# EAGLE schematic 6R_Complete (EAGLE 9.5.0)
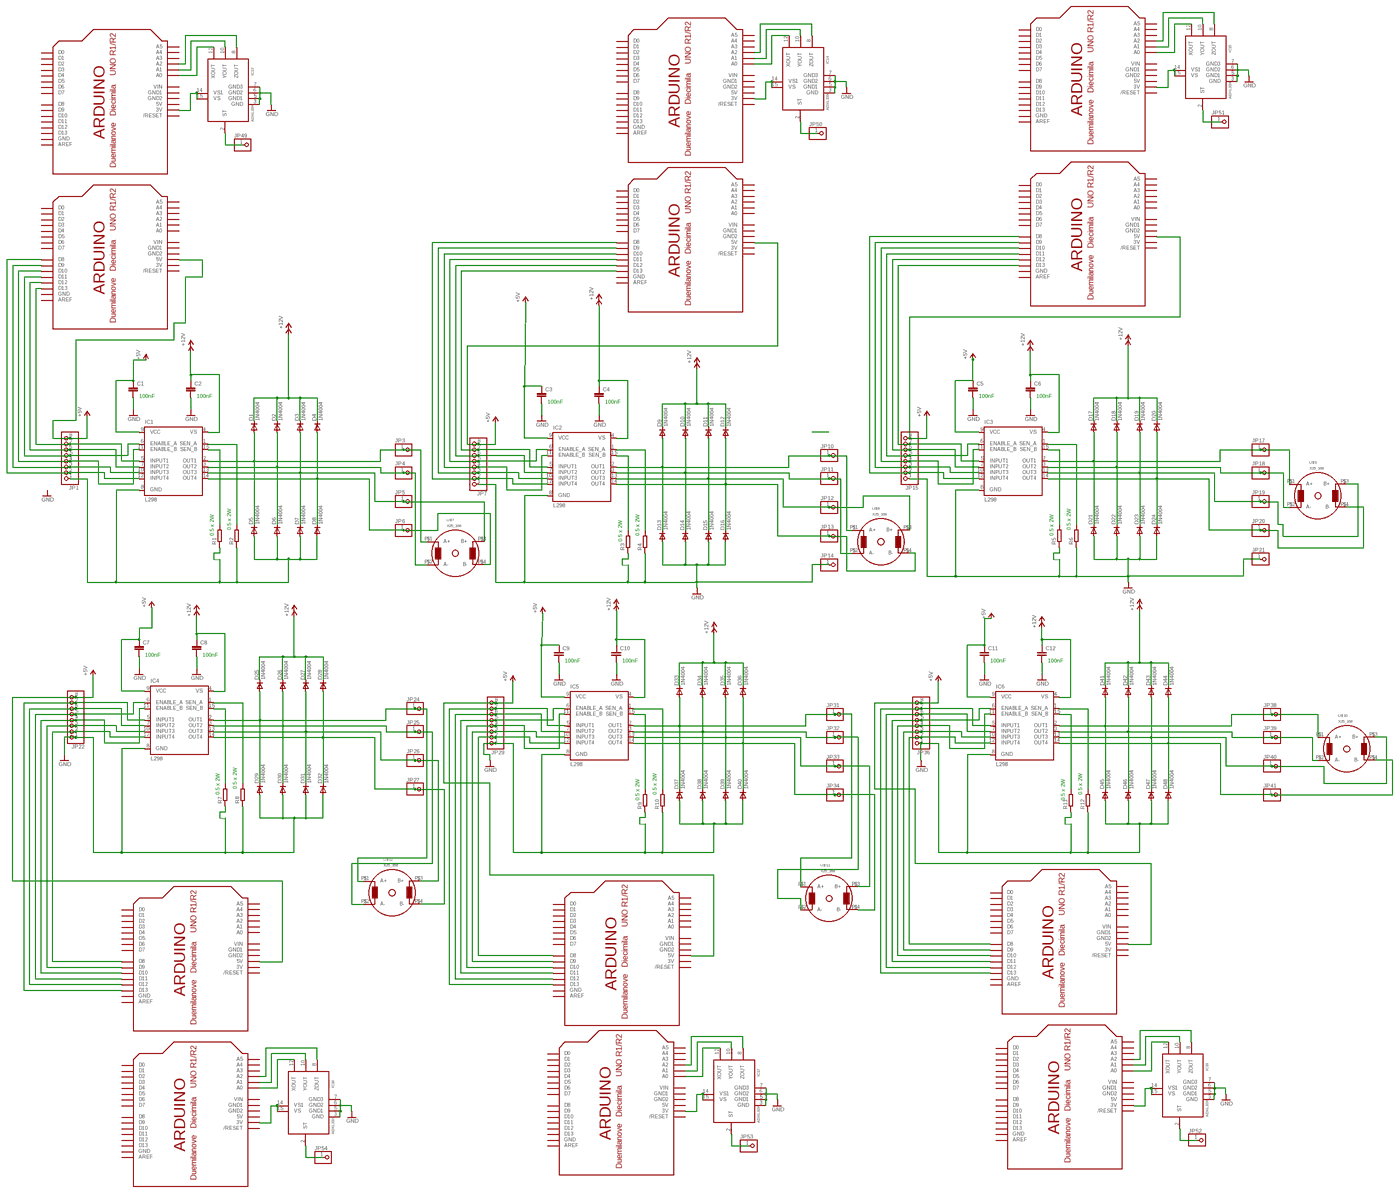
[diagram p0: schematic, sheet 1, overview]
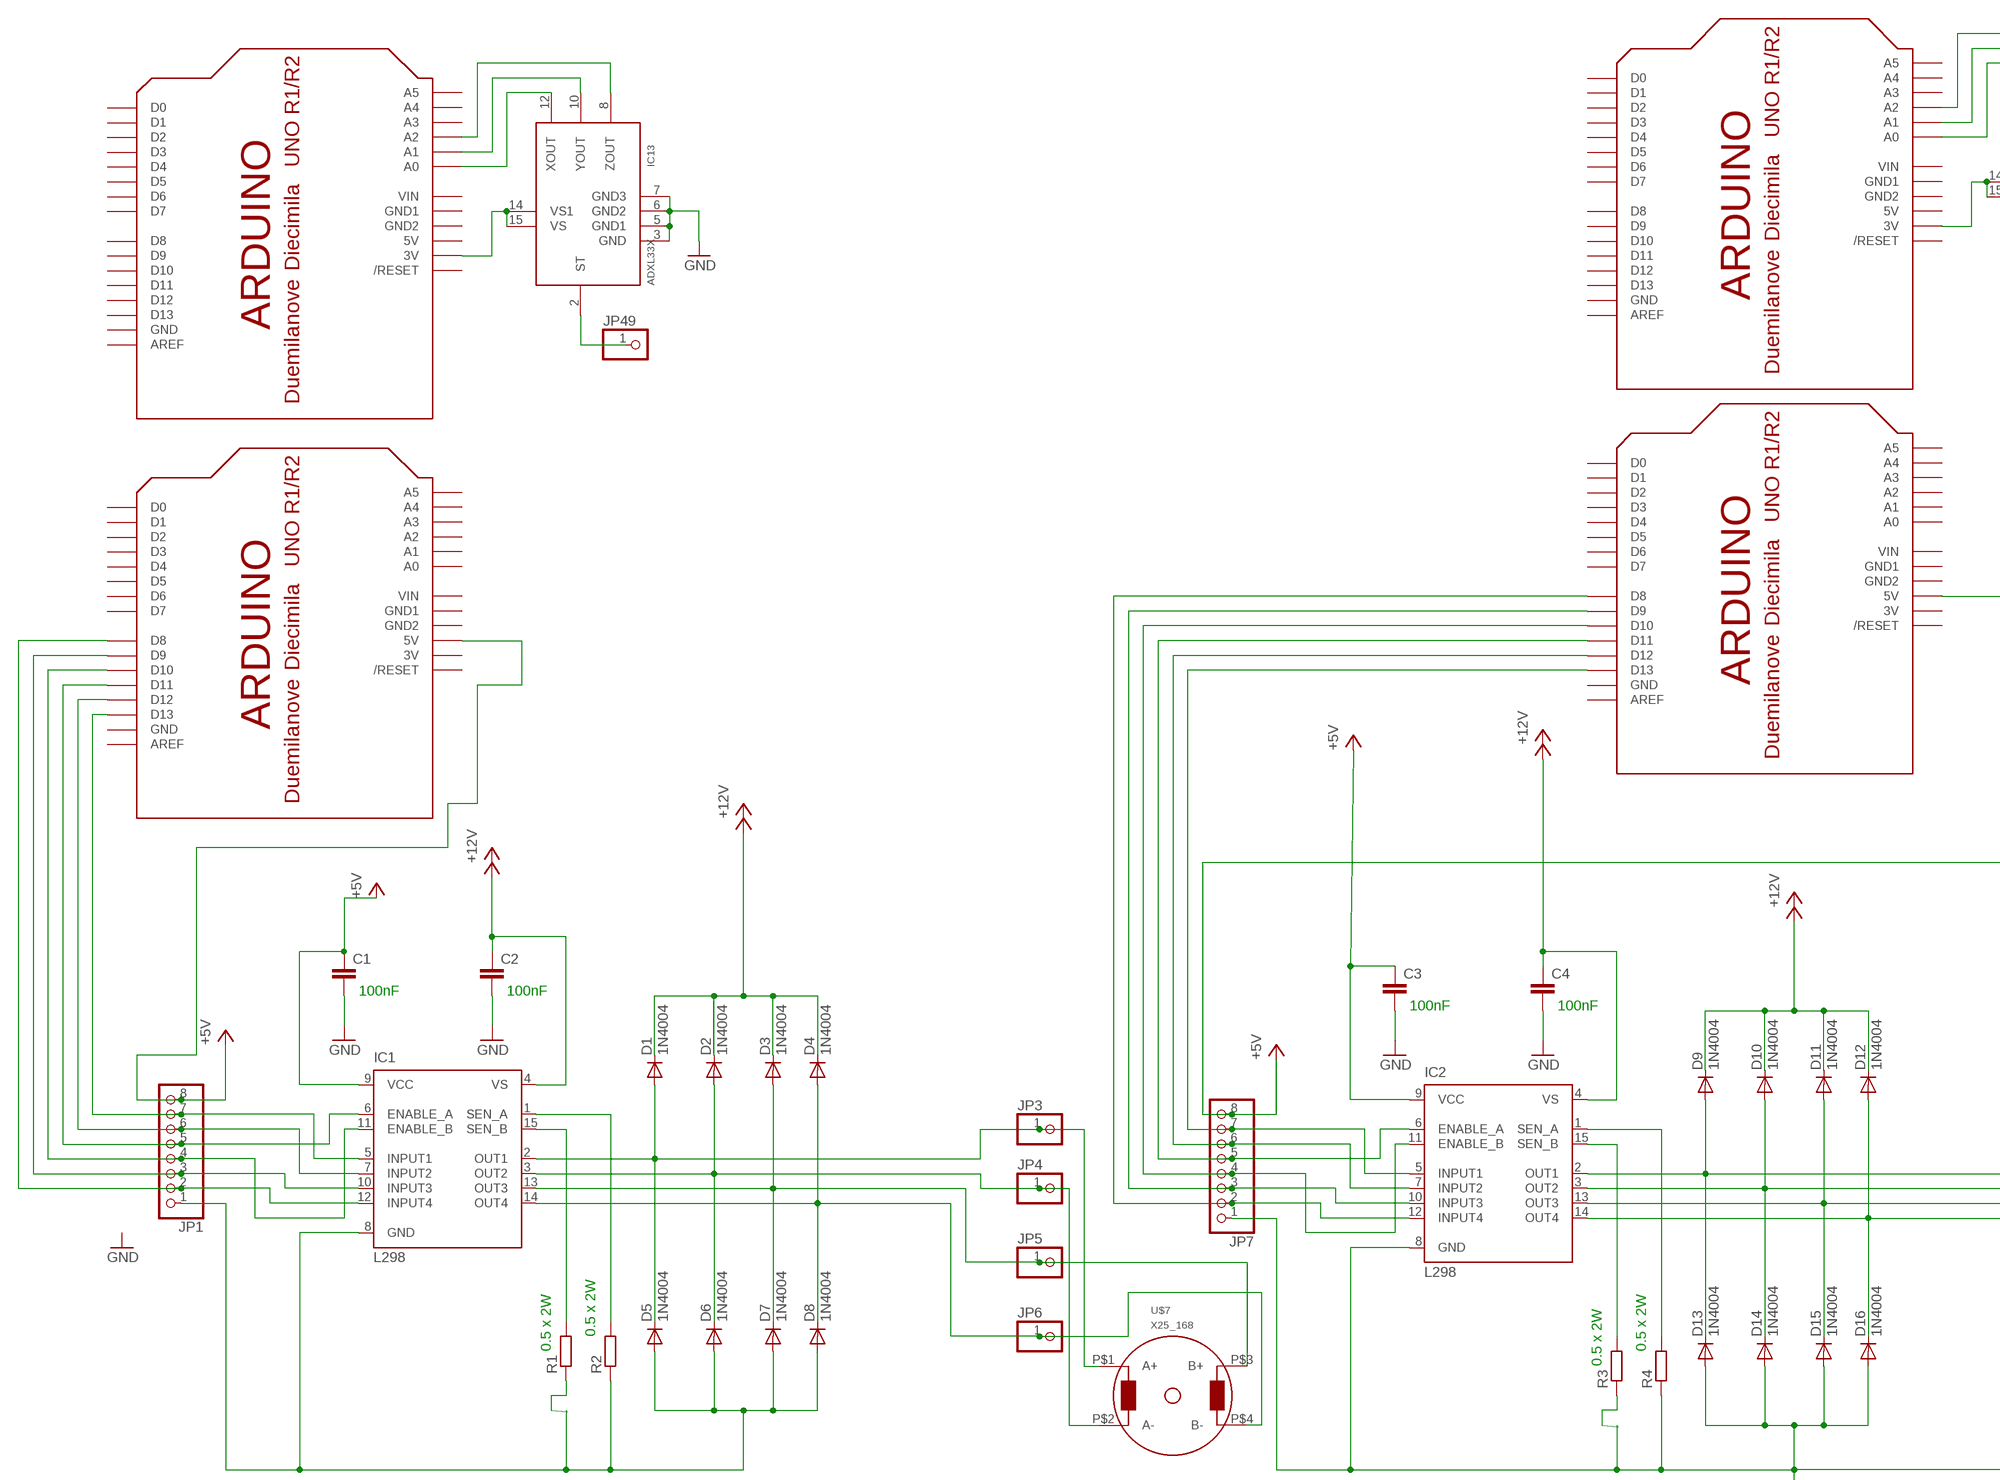
[diagram p1: schematic, sheet 1, part 1 of 4]
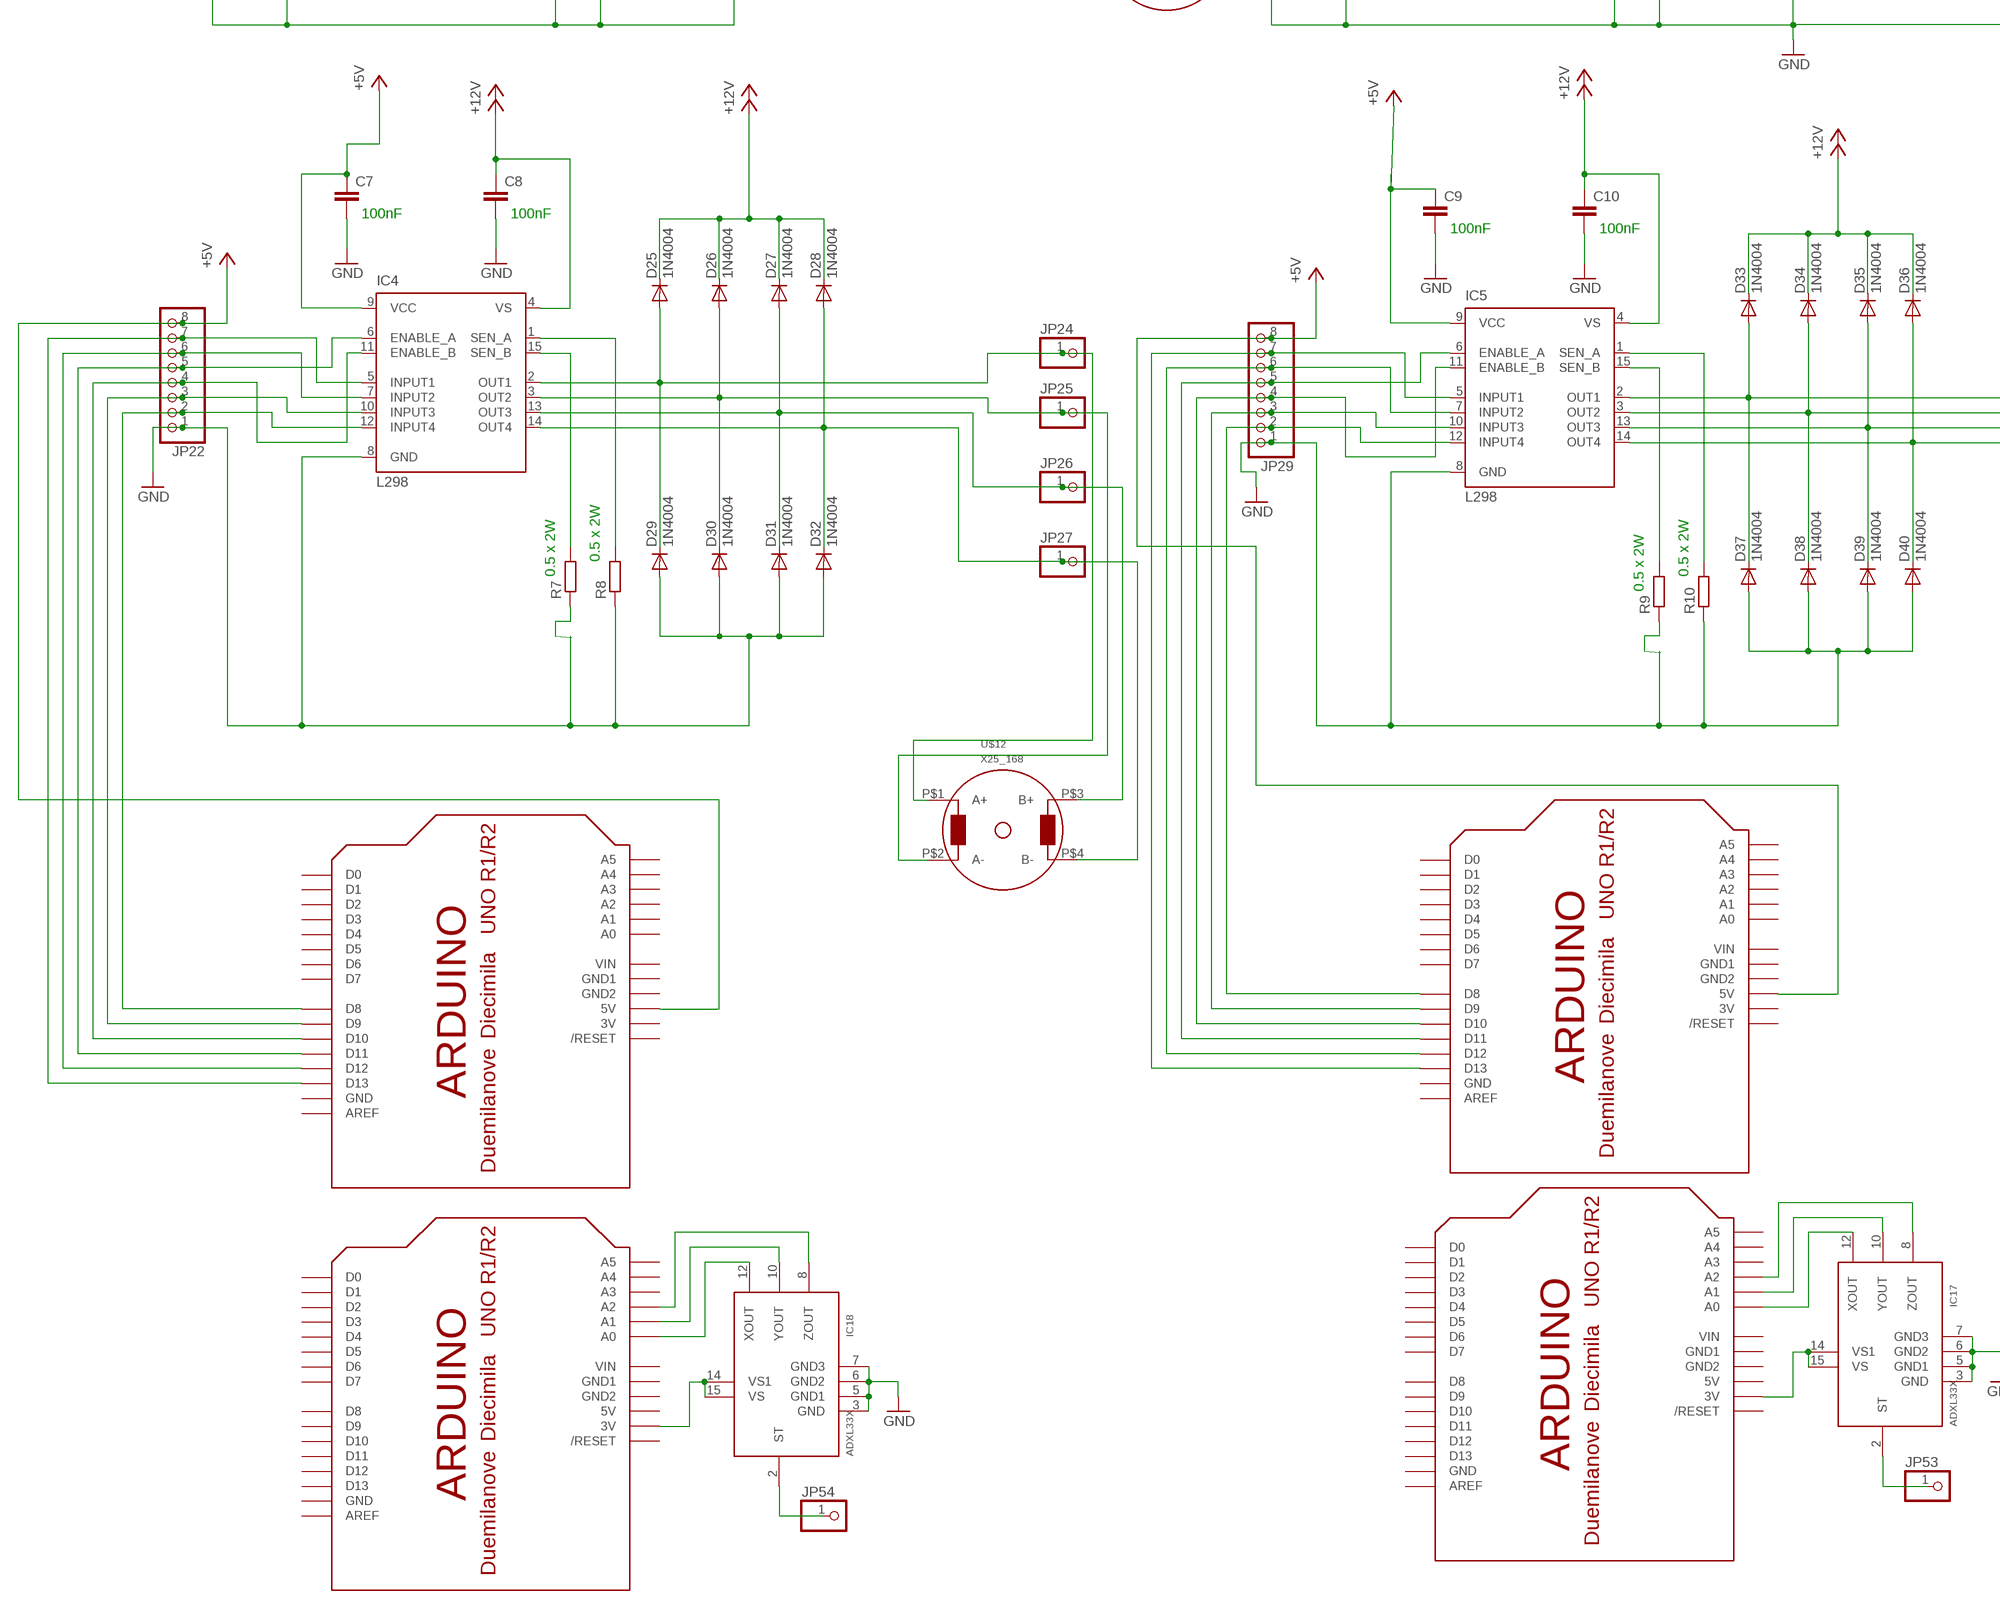
[diagram p2: schematic, sheet 1, part 2 of 4]
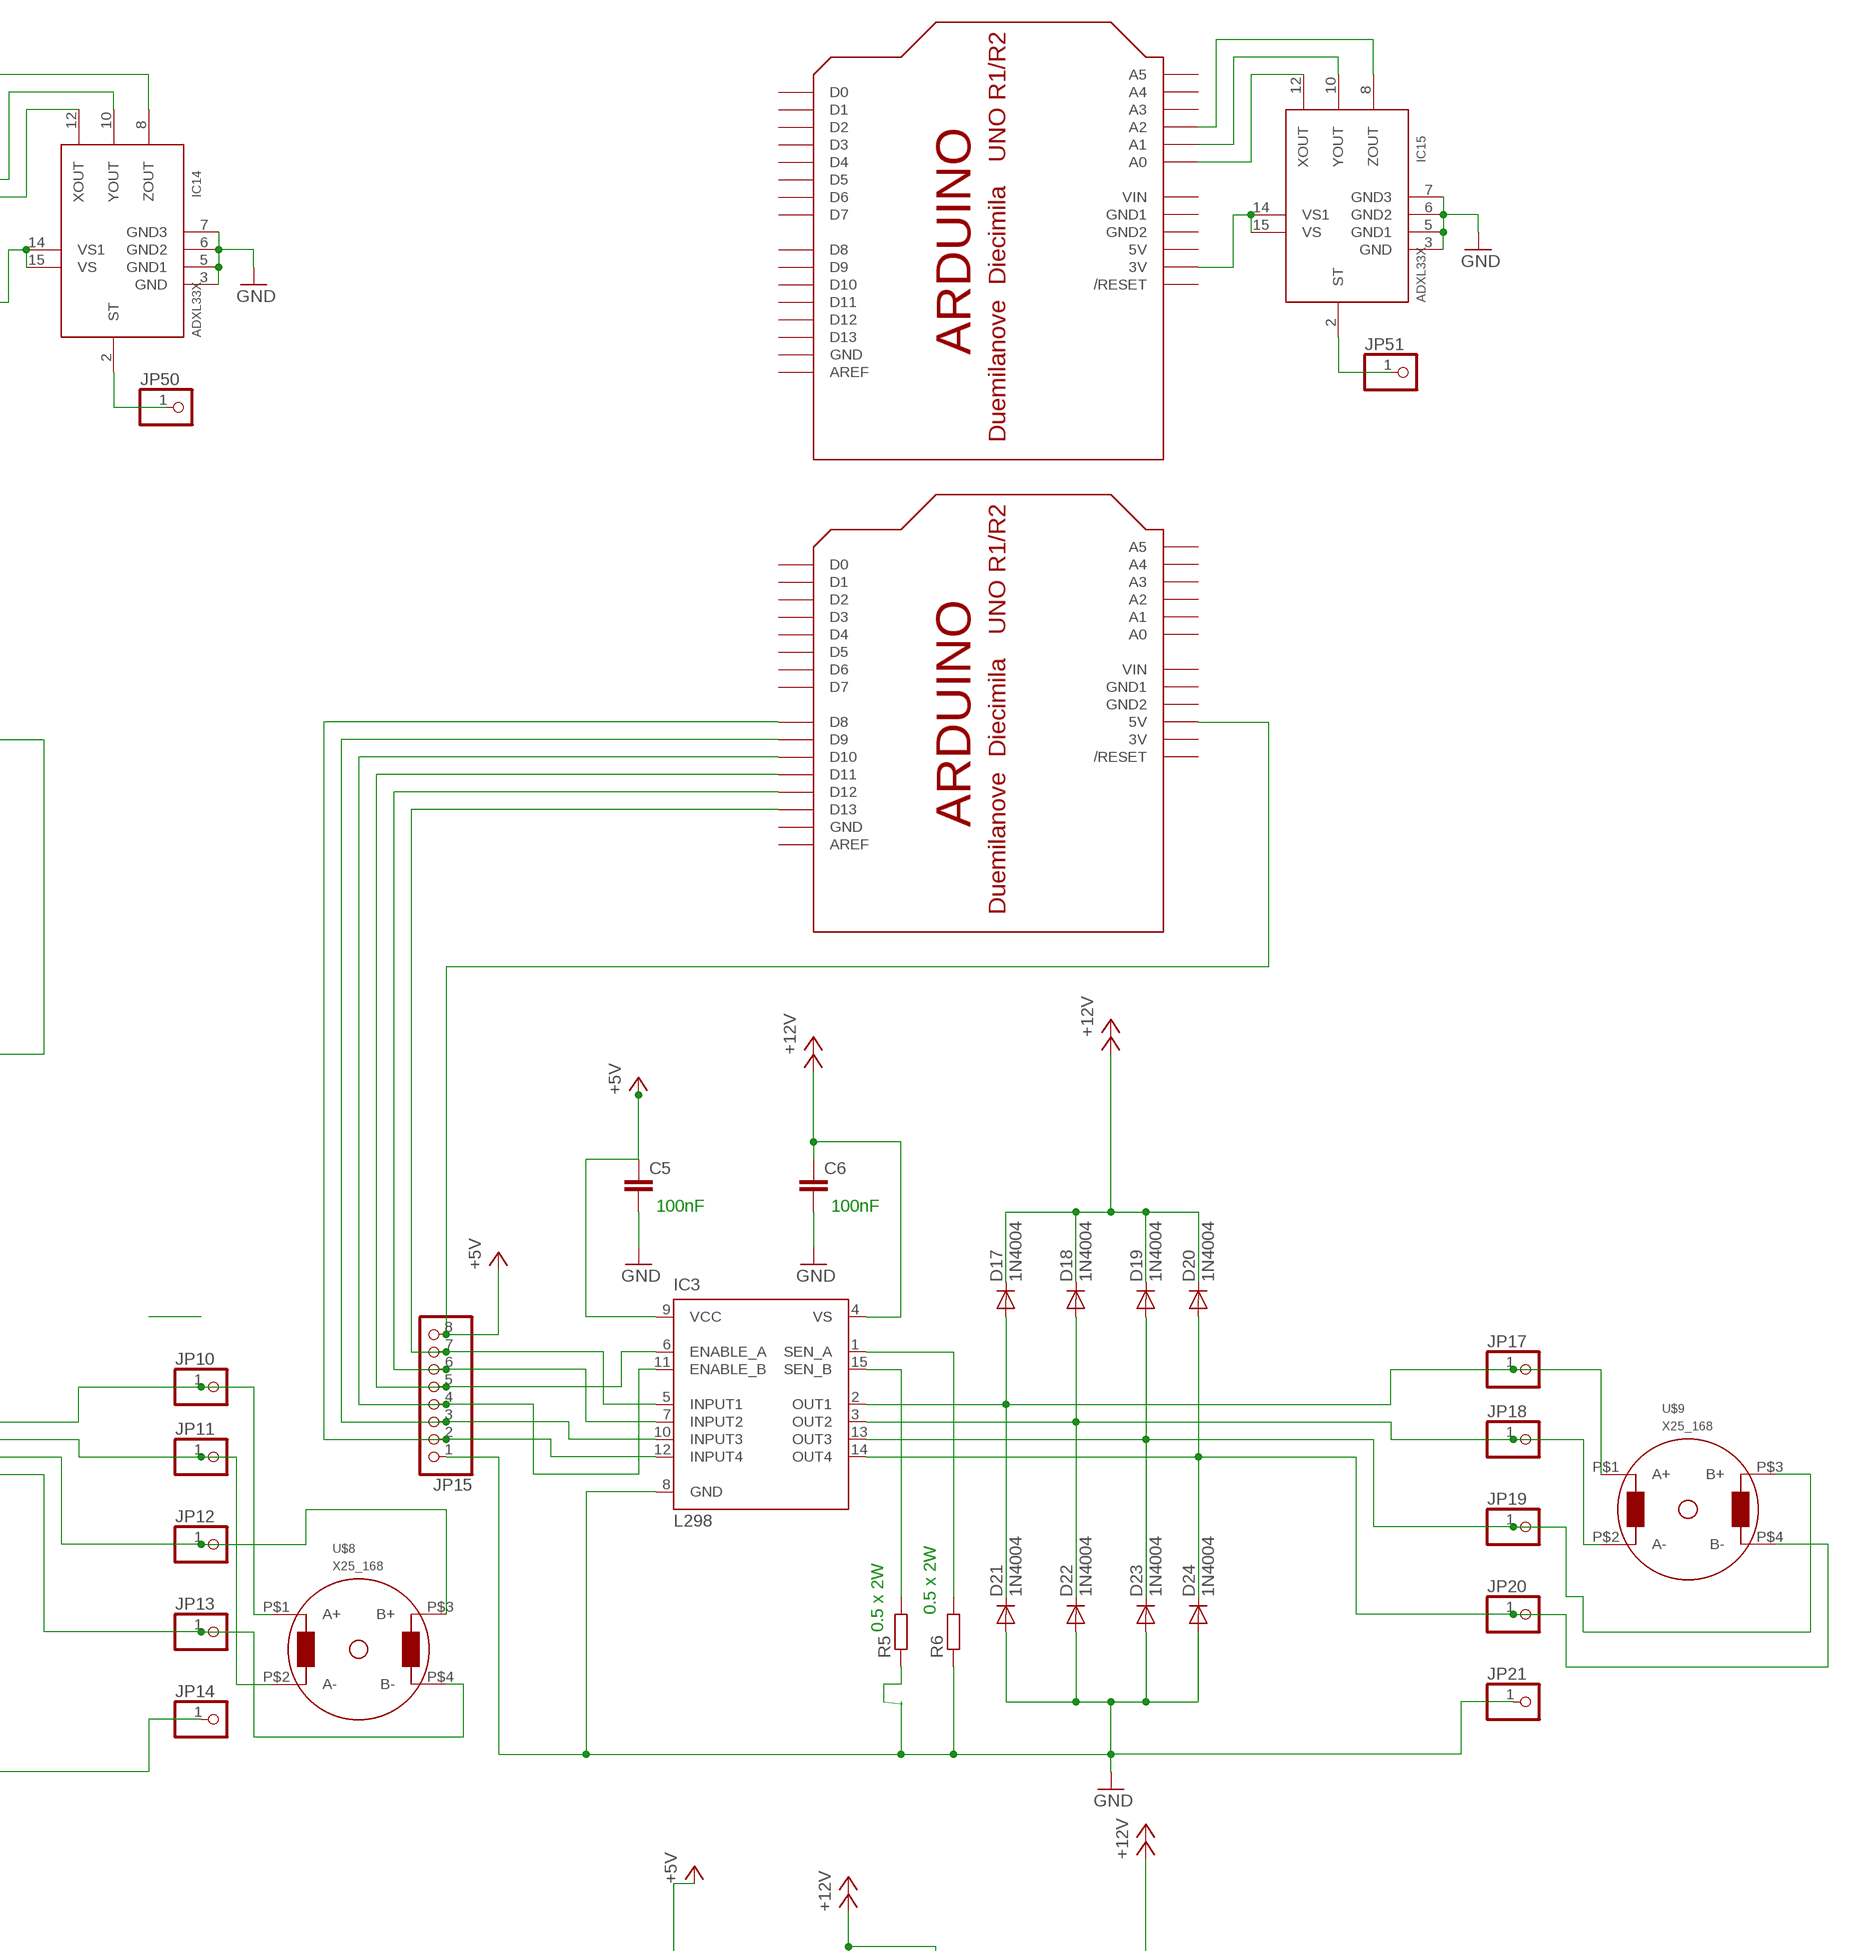
[diagram p3: schematic, sheet 1, part 3 of 4]
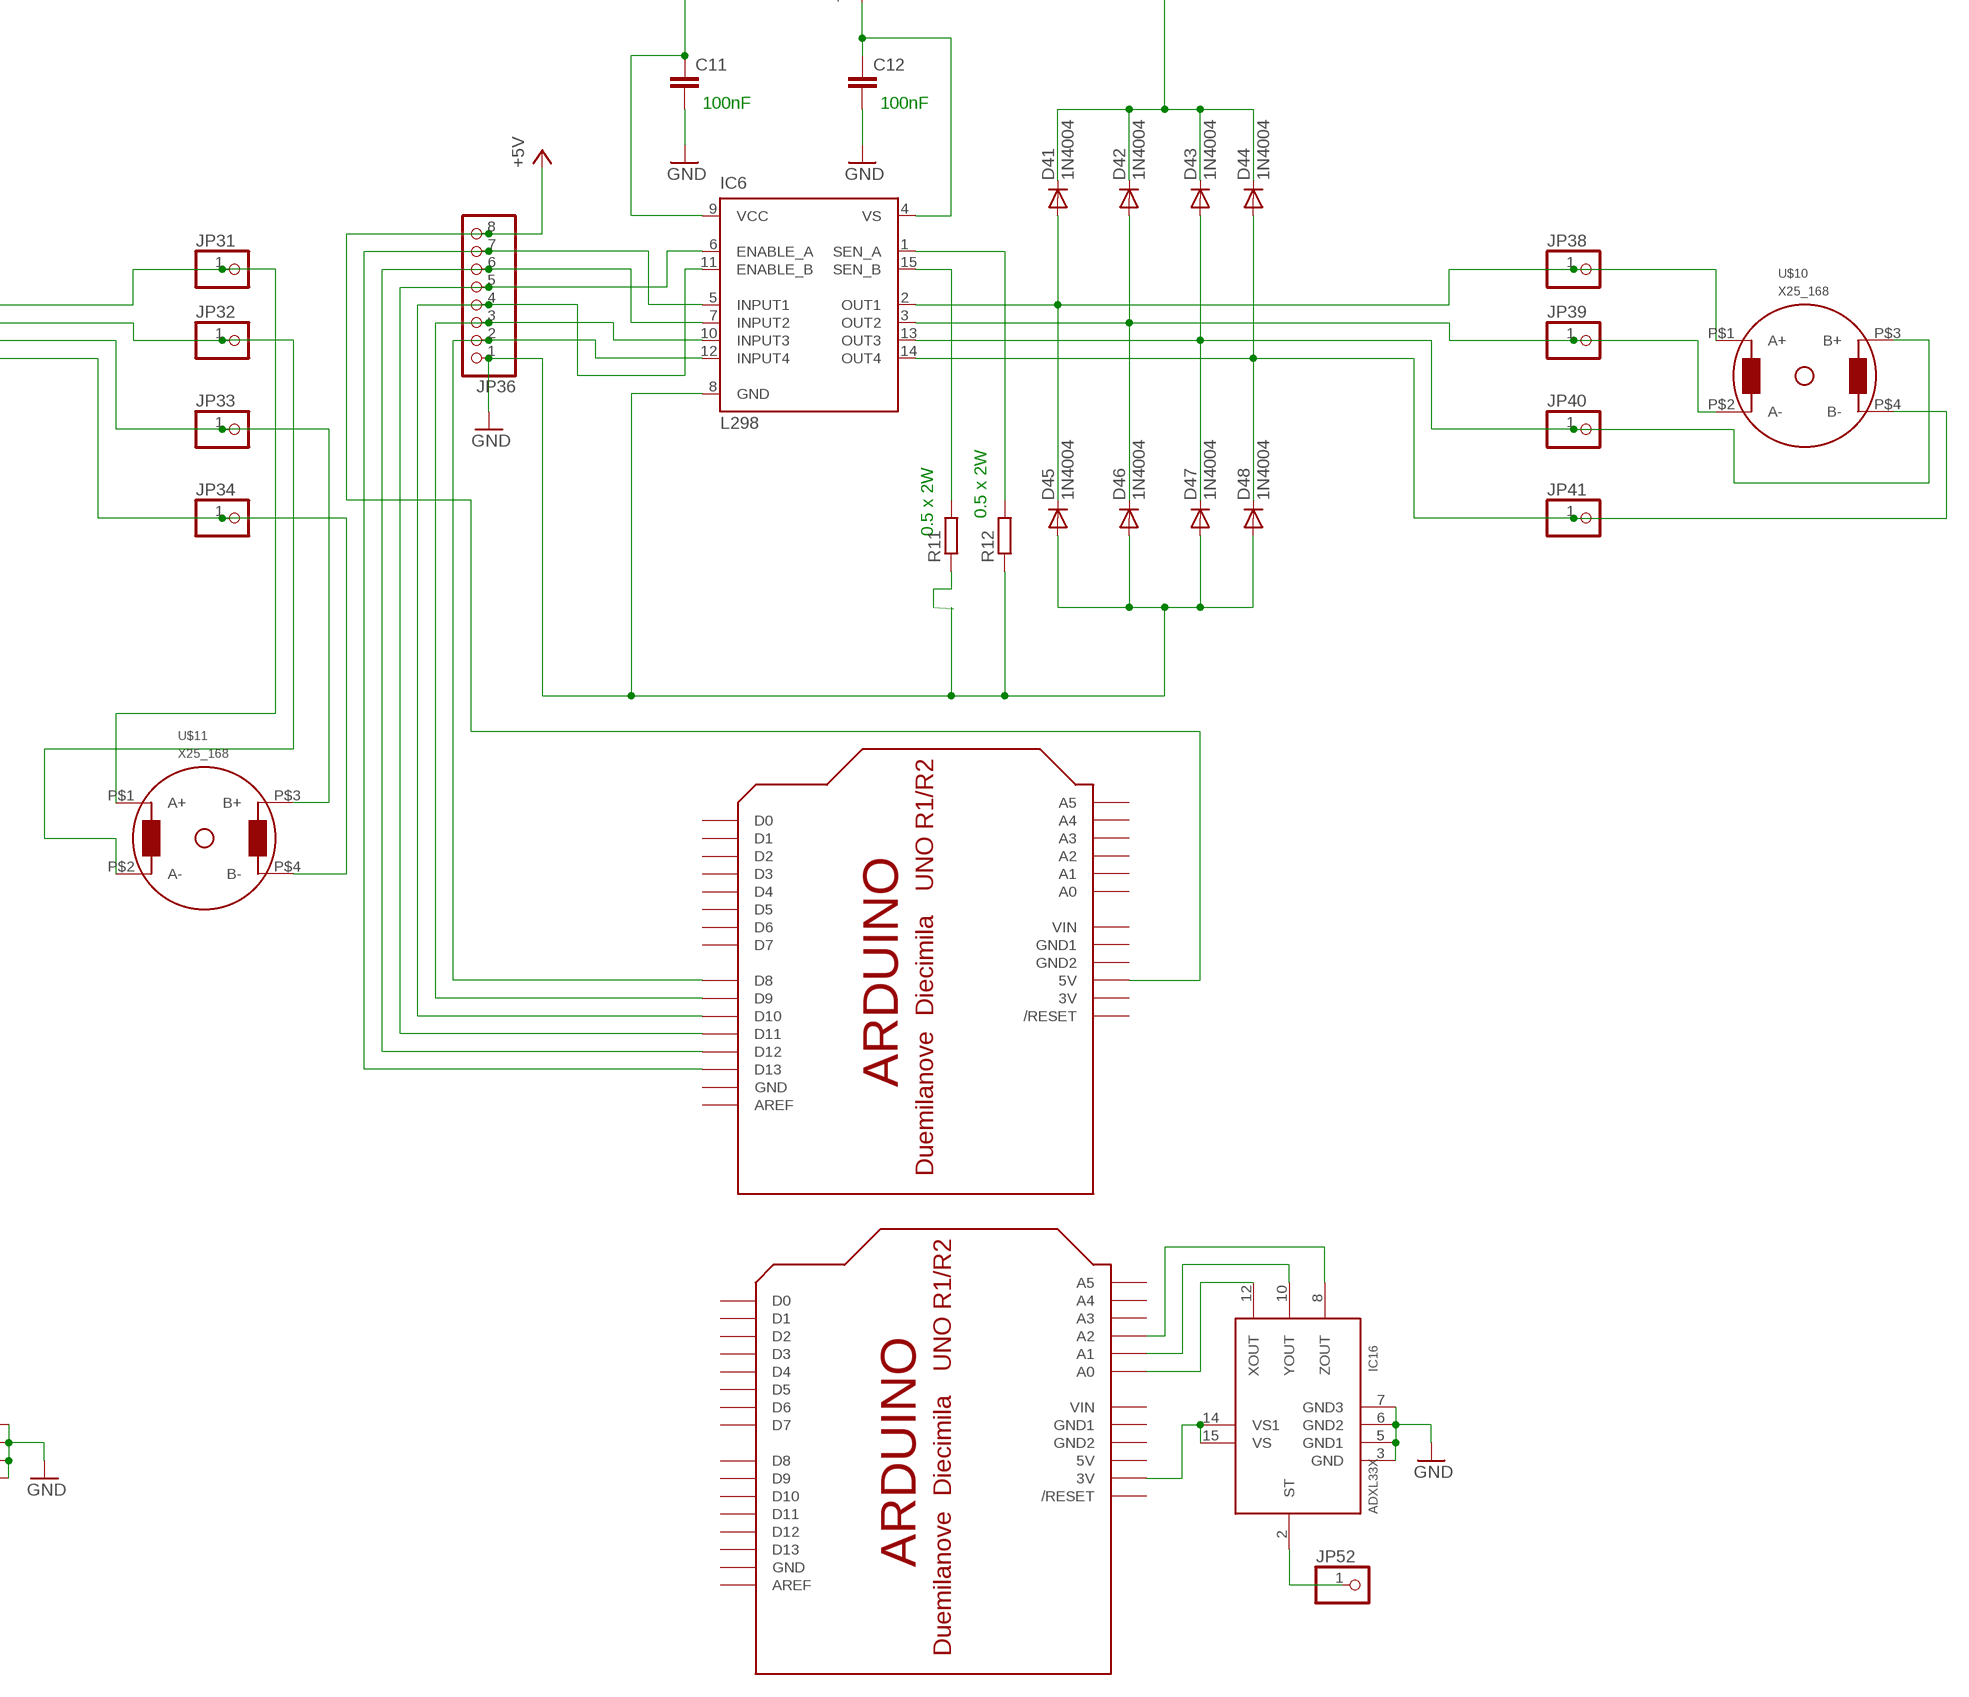
[diagram p4: schematic, sheet 1, part 4 of 4]

## Parts
C1  C2,5-3  [C2.5-3]
C2  C2,5-3  [C2.5-3]
C3  C2,5-3  [C2.5-3]
C4  C2,5-3  [C2.5-3]
C5  C2,5-3  [C2.5-3]
C6  C2,5-3  [C2.5-3]
C7  C2,5-3  [C2.5-3]
C8  C2,5-3  [C2.5-3]
C9  C2,5-3  [C2.5-3]
C10  C2,5-3  [C2.5-3]
C11  C2,5-3  [C2.5-3]
C12  C2,5-3  [C2.5-3]
D1  1N4004  [DO41-10]
D2  1N4004  [DO41-10]
D3  1N4004  [DO41-10]
D4  1N4004  [DO41-10]
D5  1N4004  [DO41-10]
D6  1N4004  [DO41-10]
D7  1N4004  [DO41-10]
D8  1N4004  [DO41-10]
D9  1N4004  [DO41-10]
D10  1N4004  [DO41-10]
D11  1N4004  [DO41-10]
D12  1N4004  [DO41-10]
D13  1N4004  [DO41-10]
D14  1N4004  [DO41-10]
D15  1N4004  [DO41-10]
D16  1N4004  [DO41-10]
D17  1N4004  [DO41-10]
D18  1N4004  [DO41-10]
D19  1N4004  [DO41-10]
D20  1N4004  [DO41-10]
D21  1N4004  [DO41-10]
D22  1N4004  [DO41-10]
D23  1N4004  [DO41-10]
D24  1N4004  [DO41-10]
D25  1N4004  [DO41-10]
D26  1N4004  [DO41-10]
D27  1N4004  [DO41-10]
D28  1N4004  [DO41-10]
D29  1N4004  [DO41-10]
D30  1N4004  [DO41-10]
D31  1N4004  [DO41-10]
D32  1N4004  [DO41-10]
D33  1N4004  [DO41-10]
D34  1N4004  [DO41-10]
D35  1N4004  [DO41-10]
D36  1N4004  [DO41-10]
D37  1N4004  [DO41-10]
D38  1N4004  [DO41-10]
D39  1N4004  [DO41-10]
D40  1N4004  [DO41-10]
D41  1N4004  [DO41-10]
D42  1N4004  [DO41-10]
D43  1N4004  [DO41-10]
D44  1N4004  [DO41-10]
D45  1N4004  [DO41-10]
D46  1N4004  [DO41-10]
D47  1N4004  [DO41-10]
D48  1N4004  [DO41-10]
IC1  L298  [MULTIWATT-15]
IC2  L298  [MULTIWATT-15]
IC3  L298  [MULTIWATT-15]
IC4  L298  [MULTIWATT-15]
IC5  L298  [MULTIWATT-15]
IC6  L298  [MULTIWATT-15]
IC13  ADXL33X  [16LCSP]
IC14  ADXL33X  [16LCSP]
IC15  ADXL33X  [16LCSP]
IC16  ADXL33X  [16LCSP]
IC17  ADXL33X  [16LCSP]
IC18  ADXL33X  [16LCSP]
JP1  PINHD-1X8-3.5MM  [1X08-3.5MM]
JP3  PINHD-1X1  [1X01]
JP4  PINHD-1X1  [1X01]
JP5  PINHD-1X1  [1X01]
JP6  PINHD-1X1  [1X01]
JP7  PINHD-1X8-3.5MM  [1X08-3.5MM]
JP10  PINHD-1X1  [1X01]
JP11  PINHD-1X1  [1X01]
JP12  PINHD-1X1  [1X01]
JP13  PINHD-1X1  [1X01]
JP14  PINHD-1X1  [1X01]
JP15  PINHD-1X8-3.5MM  [1X08-3.5MM]
JP17  PINHD-1X1  [1X01]
JP18  PINHD-1X1  [1X01]
JP19  PINHD-1X1  [1X01]
JP20  PINHD-1X1  [1X01]
JP21  PINHD-1X1  [1X01]
JP22  PINHD-1X8-3.5MM  [1X08-3.5MM]
JP24  PINHD-1X1  [1X01]
JP25  PINHD-1X1  [1X01]
JP26  PINHD-1X1  [1X01]
JP27  PINHD-1X1  [1X01]
JP29  PINHD-1X8-3.5MM  [1X08-3.5MM]
JP31  PINHD-1X1  [1X01]
JP32  PINHD-1X1  [1X01]
JP33  PINHD-1X1  [1X01]
JP34  PINHD-1X1  [1X01]
JP36  PINHD-1X8-3.5MM  [1X08-3.5MM]
JP38  PINHD-1X1  [1X01]
JP39  PINHD-1X1  [1X01]
JP40  PINHD-1X1  [1X01]
JP41  PINHD-1X1  [1X01]
JP49  PINHD-1X1  [1X01]
JP50  PINHD-1X1  [1X01]
JP51  PINHD-1X1  [1X01]
JP52  PINHD-1X1  [1X01]
JP53  PINHD-1X1  [1X01]
JP54  PINHD-1X1  [1X01]
R1  R-EU_0204/7  [0204/7]
R2  R-EU_0204/7  [0204/7]
R3  R-EU_0204/7  [0204/7]
R4  R-EU_0204/7  [0204/7]
R5  R-EU_0204/7  [0204/7]
R6  R-EU_0204/7  [0204/7]
R7  R-EU_0204/7  [0204/7]
R8  R-EU_0204/7  [0204/7]
R9  R-EU_0204/7  [0204/7]
R10  R-EU_0204/7  [0204/7]
R11  R-EU_0204/7  [0204/7]
R12  R-EU_0204/7  [0204/7]
U$1  ARDUINO-BPLACE  [ARDUINO-BPLACE]
U$2  ARDUINO-BPLACE  [ARDUINO-BPLACE]
U$3  ARDUINO-BPLACE  [ARDUINO-BPLACE]
U$4  ARDUINO-BPLACE  [ARDUINO-BPLACE]
U$5  ARDUINO-BPLACE  [ARDUINO-BPLACE]
U$6  ARDUINO-BPLACE  [ARDUINO-BPLACE]
U$7  X25_168  [X25_168]
U$8  X25_168  [X25_168]
U$9  X25_168  [X25_168]
U$10  X25_168  [X25_168]
U$11  X25_168  [X25_168]
U$12  X25_168  [X25_168]
U$13  ARDUINO-BPLACE  [ARDUINO-BPLACE]
U$14  ARDUINO-BPLACE  [ARDUINO-BPLACE]
U$15  ARDUINO-BPLACE  [ARDUINO-BPLACE]
U$16  ARDUINO-BPLACE  [ARDUINO-BPLACE]
U$17  ARDUINO-BPLACE  [ARDUINO-BPLACE]
U$18  ARDUINO-BPLACE  [ARDUINO-BPLACE]

## Nets
GND: C1.2 C2.2 C3.2 C4.2 C5.2 C6.2 C7.2 C8.2 C9.2 C10.2 C11.2 C12.2 D13.A D14.A D15.A D16.A D21.A D22.A D23.A D24.A D29.A D30.A D31.A D32.A D37.A D38.A D39.A D40.A D45.A D46.A D47.A D48.A IC2.8(GND) IC3.8(GND) IC4.8(GND) IC5.8(GND) IC6.8(GND) IC13.3(GND) IC13.5(GND1) IC13.6(GND2) IC13.7(GND3) IC14.3(GND) IC14.5(GND1) IC14.6(GND2) IC14.7(GND3) IC15.3(GND) IC15.5(GND1) IC15.6(GND2) IC15.7(GND3) IC16.3(GND) IC16.5(GND1) IC16.6(GND2) IC16.7(GND3) IC17.3(GND) IC17.5(GND1) IC17.6(GND2) IC17.7(GND3) IC18.3(GND) IC18.5(GND1) IC18.6(GND2) IC18.7(GND3) JP7.1 JP14.1 JP15.1 JP21.1 JP22.1 JP29.1 JP36.1 R4.1 R6.1 R8.1 R10.1 R12.1
N$1: IC2.5(INPUT1) JP7.7 U$2.D13
N$2: IC1.1(SEN_A) R2.2
N$3: IC1.5(INPUT1) JP1.7 U$1.D13
N$4: IC1.7(INPUT2) JP1.6 U$1.D12
N$5: IC1.6(ENABLE_A) JP1.5 U$1.D11
N$6: IC1.15(SEN_B) R1.2
N$7: IC1.10(INPUT3) JP1.3 U$1.D9
N$8: IC1.12(INPUT4) JP1.2 U$1.D8
N$9: IC1.11(ENABLE_B) JP1.4 U$1.D10
N$10: D4.A D8.C IC1.14(OUT4) JP6.1 U$7.P$4(B-)
N$11: D1.A D5.C IC1.2(OUT1) JP3.1 U$7.P$1(A+)
N$12: D2.A D6.C IC1.3(OUT2) JP4.1 U$7.P$2(A-)
N$13: D3.A D7.C IC1.13(OUT3) JP5.1 U$7.P$3(B+)
N$14: IC2.7(INPUT2) JP7.6 U$2.D12
N$15: IC2.6(ENABLE_A) JP7.5 U$2.D11
N$16: IC2.10(INPUT3) JP7.3 U$2.D9
N$17: IC2.12(INPUT4) JP7.2 U$2.D8
N$18: IC2.11(ENABLE_B) JP7.4 U$2.D10
N$19: IC2.1(SEN_A) R4.2
N$20: IC2.15(SEN_B) R3.2
N$21: D9.A D13.C IC2.2(OUT1) JP10.1 U$8.P$1(A+)
N$22: D10.A D14.C IC2.3(OUT2) JP11.1 U$8.P$2(A-)
N$23: D11.A D15.C IC2.13(OUT3) JP12.1 U$8.P$3(B+)
N$24: D12.A D16.C IC2.14(OUT4) JP13.1 U$8.P$4(B-)
N$25: IC3.5(INPUT1) JP15.7 U$3.D13
N$26: IC3.7(INPUT2) JP15.6 U$3.D12
N$27: IC3.6(ENABLE_A) JP15.5 U$3.D11
N$28: IC3.10(INPUT3) JP15.3 U$3.D9
N$29: IC3.12(INPUT4) JP15.2 U$3.D8
N$30: IC3.11(ENABLE_B) JP15.4 U$3.D10
N$31: IC3.1(SEN_A) R6.2
N$32: IC3.15(SEN_B) R5.2
N$33: D17.A D21.C IC3.2(OUT1) JP17.1 U$9.P$1(A+)
N$34: D18.A D22.C IC3.3(OUT2) JP18.1 U$9.P$2(A-)
N$35: IC13.12(XOUT) U$13.A0
N$36: D20.A D24.C IC3.14(OUT4) JP20.1 U$9.P$4(B-)
N$37: IC4.5(INPUT1) JP22.7 U$6.D13
N$38: IC4.7(INPUT2) JP22.6 U$6.D12
N$39: IC4.6(ENABLE_A) JP22.5 U$6.D11
N$40: IC4.10(INPUT3) JP22.3 U$6.D9
N$41: IC4.12(INPUT4) JP22.2 U$6.D8
N$42: IC4.11(ENABLE_B) JP22.4 U$6.D10
N$43: IC4.1(SEN_A) R8.2
N$44: IC4.15(SEN_B) R7.2
N$45: D25.A D29.C IC4.2(OUT1) JP24.1 U$12.P$1(A+)
N$46: D26.A D30.C IC4.3(OUT2) JP25.1 U$12.P$2(A-)
N$47: D27.A D31.C IC4.13(OUT3) JP26.1 U$12.P$3(B+)
N$48: D28.A D32.C IC4.14(OUT4) JP27.1 U$12.P$4(B-)
N$49: IC5.5(INPUT1) JP29.7 U$5.D13
N$50: IC5.7(INPUT2) JP29.6 U$5.D12
N$51: IC5.6(ENABLE_A) JP29.5 U$5.D11
N$52: IC5.10(INPUT3) JP29.3 U$5.D9
N$53: IC5.12(INPUT4) JP29.2 U$5.D8
N$54: IC5.11(ENABLE_B) JP29.4 U$5.D10
N$55: IC5.1(SEN_A) R10.2
N$56: IC5.15(SEN_B) R9.2
N$60: D36.A D40.C IC5.14(OUT4) JP34.1 U$11.P$4(B-)
N$61: IC6.5(INPUT1) JP36.7 U$4.D13
N$62: IC6.7(INPUT2) JP36.6 U$4.D12
N$63: IC6.6(ENABLE_A) JP36.5 U$4.D11
N$64: IC6.10(INPUT3) JP36.3 U$4.D9
N$65: IC6.12(INPUT4) JP36.2 U$4.D8
N$66: IC6.11(ENABLE_B) JP36.4 U$4.D10
N$67: IC6.1(SEN_A) R12.2
N$68: IC6.15(SEN_B) R11.2
N$69: D41.A D45.C IC6.2(OUT1) JP38.1 U$10.P$1(A+)
N$70: D42.A D46.C IC6.3(OUT2) JP39.1 U$10.P$2(A-)
N$71: D43.A D47.C IC6.13(OUT3) JP40.1 U$10.P$3(B+)
N$72: D44.A D48.C IC6.14(OUT4) JP41.1 U$10.P$4(B-)
N$74: R3.1
N$76: R1.1
N$77: D5.A D6.A D7.A D8.A IC1.8(GND) JP1.1 R2.1
N$78: R5.1
N$79: D33.A D37.C IC5.2(OUT1) JP31.1 U$11.P$1(A+)
N$80: R7.1
N$81: R9.1
N$82: R11.1
N$83: D34.A D38.C IC5.3(OUT2) JP32.1 U$11.P$2(A-)
N$84: D35.A D39.C IC5.13(OUT3) JP33.1 U$11.P$3(B+)
N$105: IC13.10(YOUT) U$13.A1
N$106: D19.A D23.C IC3.13(OUT3) JP19.1 U$9.P$3(B+)
N$107: IC13.8(ZOUT) U$13.A2
N$108: IC13.2(ST) JP49.1
N$109: IC14.12(XOUT) U$14.A0
N$110: IC14.10(YOUT) U$14.A1
N$111: IC14.8(ZOUT) U$14.A2
N$112: IC14.2(ST) JP50.1
N$113: IC15.12(XOUT) U$15.A0
N$114: IC15.10(YOUT) U$15.A1
N$115: IC15.8(ZOUT) U$15.A2
N$116: IC15.2(ST) JP51.1
N$117: IC16.12(XOUT) U$16.A0
N$118: IC16.10(YOUT) U$16.A1
N$119: IC16.8(ZOUT) U$16.A2
N$120: IC16.2(ST) JP52.1
N$121: IC17.12(XOUT) U$17.A0
N$122: IC17.10(YOUT) U$17.A1
N$123: IC17.8(ZOUT) U$17.A2
N$124: IC17.2(ST) JP53.1
N$125: IC18.12(XOUT) U$18.A0
N$126: IC18.10(YOUT) U$18.A1
N$127: IC18.8(ZOUT) U$18.A2
N$128: IC18.2(ST) JP54.1
VCC: C1.1 C2.1 C3.1 C4.1 C5.1 C6.1 C7.1 C8.1 C9.1 C10.1 C11.1 C12.1 D1.C D2.C D3.C D4.C D9.C D10.C D11.C D12.C D17.C D18.C D19.C D20.C D25.C D26.C D27.C D28.C D33.C D34.C D35.C D36.C D41.C D42.C D43.C D44.C IC1.4(VS) IC1.9(VCC) IC2.4(VS) IC2.9(VCC) IC3.4(VS) IC3.9(VCC) IC4.4(VS) IC4.9(VCC) IC5.4(VS) IC5.9(VCC) IC6.4(VS) IC6.9(VCC) JP1.8 JP7.8 JP15.8 JP22.8 JP29.8 JP36.8 U$1.5V U$2.5V U$3.5V U$4.5V U$5.5V U$6.5V ; supply symbol labelled +5V, +12V
VS1: IC13.14(VS1) IC13.15(VS) IC14.14(VS1) IC14.15(VS) IC15.14(VS1) IC15.15(VS) IC16.14(VS1) IC16.15(VS) IC17.14(VS1) IC17.15(VS) IC18.14(VS1) IC18.15(VS) U$13.3V U$14.3V U$15.3V U$16.3V U$17.3V U$18.3V
Unconnected: U$1.A0 U$1.A1 U$1.A2 U$1.A3 U$1.A4 U$1.A5 U$1.AREF U$1.D0 U$1.D1 U$1.D2 U$1.D3 U$1.D4 U$1.D5 U$1.D6 U$1.D7 U$1.RESET(/RESET) U$2.A0 U$2.A1 U$2.A2 U$2.A3 U$2.A4 U$2.A5 U$2.AREF U$2.D0 U$2.D1 U$2.D2 U$2.D3 U$2.D4 U$2.D5 U$2.D6 U$2.D7 U$2.RESET(/RESET) U$3.A0 U$3.A1 U$3.A2 U$3.A3 U$3.A4 U$3.A5 U$3.AREF U$3.D0 U$3.D1 U$3.D2 U$3.D3 U$3.D4 U$3.D5 U$3.D6 U$3.D7 U$3.RESET(/RESET) U$4.A0 U$4.A1 U$4.A2 U$4.A3 U$4.A4 U$4.A5 U$4.AREF U$4.D0 U$4.D1 U$4.D2 U$4.D3 U$4.D4 U$4.D5 U$4.D6 U$4.D7 U$4.RESET(/RESET) U$5.A0 U$5.A1 U$5.A2 U$5.A3 U$5.A4 U$5.A5 U$5.AREF U$5.D0 U$5.D1 U$5.D2 U$5.D3 U$5.D4 U$5.D5 U$5.D6 U$5.D7 U$5.RESET(/RESET) U$6.A0 U$6.A1 U$6.A2 U$6.A3 U$6.A4 U$6.A5 U$6.AREF U$6.D0 U$6.D1 U$6.D2 U$6.D3 U$6.D4 U$6.D5 U$6.D6 U$6.D7 U$6.RESET(/RESET) U$13.A3 U$13.A4 U$13.A5 U$13.AREF U$13.D0 U$13.D1 U$13.D2 U$13.D3 U$13.D4 U$13.D5 U$13.D6 U$13.D7 U$13.D8 U$13.D9 U$13.D10 U$13.D11 U$13.D12 U$13.D13 U$13.RESET(/RESET) U$14.A3 U$14.A4 U$14.A5 U$14.AREF U$14.D0 U$14.D1 U$14.D2 U$14.D3 U$14.D4 U$14.D5 U$14.D6 U$14.D7 U$14.D8 U$14.D9 U$14.D10 U$14.D11 U$14.D12 U$14.D13 U$14.RESET(/RESET) U$15.A3 U$15.A4 U$15.A5 U$15.AREF U$15.D0 U$15.D1 U$15.D2 U$15.D3 U$15.D4 U$15.D5 U$15.D6 U$15.D7 U$15.D8 U$15.D9 U$15.D10 U$15.D11 U$15.D12 U$15.D13 U$15.RESET(/RESET) U$16.A3 U$16.A4 U$16.A5 U$16.AREF U$16.D0 U$16.D1 U$16.D2 U$16.D3 U$16.D4 U$16.D5 U$16.D6 U$16.D7 U$16.D8 U$16.D9 U$16.D10 U$16.D11 U$16.D12 U$16.D13 U$16.RESET(/RESET) U$17.A3 U$17.A4 U$17.A5 U$17.AREF U$17.D0 U$17.D1 U$17.D2 U$17.D3 U$17.D4 U$17.D5 U$17.D6 U$17.D7 U$17.D8 U$17.D9 U$17.D10 U$17.D11 U$17.D12 U$17.D13 U$17.RESET(/RESET) U$18.A3 U$18.A4 U$18.A5 U$18.AREF U$18.D0 U$18.D1 U$18.D2 U$18.D3 U$18.D4 U$18.D5 U$18.D6 U$18.D7 U$18.D8 U$18.D9 U$18.D10 U$18.D11 U$18.D12 U$18.D13 U$18.RESET(/RESET)

## Notes on the sheet
- 100nF | 100nF | 100nF | 100nF
- 100nF | 100nF
- 0.5 x 2W | 0.5 x 2W
- 0.5 x 2W | 0.5 x 2W | 0.5 x 2W
- 0.5 x 2W
- 100nF | 100nF
- 100nF | 100nF | 100nF | 100nF
- 0.5 x 2W
- 0.5 x 2W | 0.5 x 2W | 0.5 x 2W
- 0.5 x 2W | 0.5 x 2W

## Power pins joined to a net without a drawn wire
3V: U$1.3V U$2.3V U$3.3V U$4.3V U$5.3V U$6.3V
5V: U$13.5V U$14.5V U$15.5V U$16.5V U$17.5V U$18.5V
GND: U$1.GND U$2.GND U$3.GND U$4.GND U$5.GND U$6.GND U$13.GND U$14.GND U$15.GND U$16.GND U$17.GND U$18.GND
GND1: U$1.GND1 U$2.GND1 U$3.GND1 U$4.GND1 U$5.GND1 U$6.GND1 U$13.GND1 U$14.GND1 U$15.GND1 U$16.GND1 U$17.GND1 U$18.GND1
GND2: U$1.GND2 U$2.GND2 U$3.GND2 U$4.GND2 U$5.GND2 U$6.GND2 U$13.GND2 U$14.GND2 U$15.GND2 U$16.GND2 U$17.GND2 U$18.GND2
VIN: U$1.VIN U$2.VIN U$3.VIN U$4.VIN U$5.VIN U$6.VIN U$13.VIN U$14.VIN U$15.VIN U$16.VIN U$17.VIN U$18.VIN

## Library data of the parts
C1-C12 = capacitor-wima:C: CAPACITOR naming: grid - package width
D1-D48 = adafruit:1N4004: DIODE General purpose 1N400x type rectifier (With bigger pads) http://www.ladyada.net/library/pcb/eaglelibrary.html
IC1-IC6 = st-microelectronics:L298: DUAL FULL-BRIDGE DRIVER; MPN: L298N; OC_FARNELL: 1589425; OC_NEWARK: 32M1527
IC13-IC18 = adafruit:ADXL33X
JP1 JP7 JP15 JP22 JP29 JP36 = adafruit:PINHD-1X8: PIN HEADER
JP3-JP6 JP10-JP14 JP17-JP21 JP24-JP27 JP31-JP34 JP38-JP41 JP49-JP54 = adafruit:PINHD-1X1: Pin header 1x1 for 0.1" spacing With round pins
R1-R12 = rcl:R-EU_: RESISTOR, European symbol; SPICEPREFIX: R
U$1-U$6 U$13-U$18 = adafruit:ARDUINO: Arduino Diecimila/Duemilanove Make a shield with ease, this package has all the named pins as well as the two mounting drill holes and an outline of the USB and DC power connector. The outline is on the DIMENSION layer, so if your board house uses it they will cut the outline to match. http://www.ladyada.net/library/pcb/eaglelibrary.html
U$7-U$12 = x25_168:X25_168: X25168 - Miniature stepper motor for analog gauge